# EAGLE design BT-PROGRAMER (EAGLE 9.1.0)
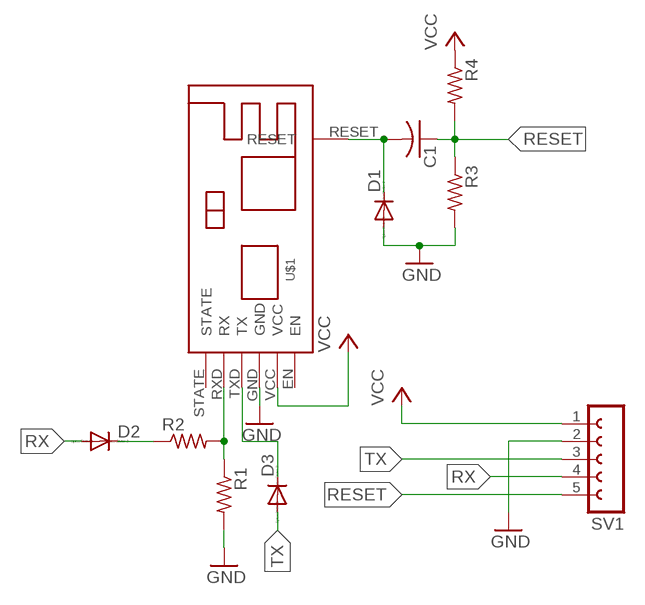
[diagram p0: schematic, sheet 1]

## Parts
C1  C-USC0603  [C0603]
D1  DIODE-DO-214AC  [DO-214AC]
D2  DIODE-DO-214AC  [DO-214AC]
D3  DIODE-DO-214AC  [DO-214AC]
R1  R-US_M1206  [M1206]
R2  R-US_M1206  [M1206]
R3  R-US_M1206  [M1206]
R4  R-US_M1206  [M1206]
SV1  FE05-1  [FE05-1]
U$1  HC-05-PROG  [HC-05-PROG]

## Nets
GND: D1.A R1.2 R3.2 SV1.2 U$1.GND
N$1: R1.1 R2.2 U$1.RXD(RX)
N$2: C1.2 D1.C U$1.RESET
N$5: D2.C R2.1
N$6: D3.C U$1.TXD(TX)
RESET: C1.1 R3.1 R4.2 SV1.5
RX: D2.A SV1.4
TX: D3.A SV1.3
VCC: R4.1 SV1.1 U$1.VCC
Unconnected: U$1.EN U$1.STATE

## Library data of the parts
C1 = rcl:C-US: CAPACITOR, American symbol; SPICEPREFIX: C
D1-D3 = diode:DIODE-: DIODE
R1-R4 = rcl:R-US_: RESISTOR, American symbol; SPICEPREFIX: R
SV1 = con-lsta:FE05-1: FEMALE HEADER; OC_FARNELL: unknown; OC_NEWARK: unknown
U$1 = hc-xx:HC-05-PROG: Con funcion adicional para programar arduino remotamente. HC-05 module is an easy to use Bluetooth SPP (Serial Port Protocol) module, designed for transparent wireless serial connection setup. Serial port Bluetooth module is fully qualified Bluetooth V2.0+EDR (Enhanced Data Rate) 3Mbps Modulation with complete 2.4GHz radio transceiver and baseband. It uses CSR Bluecore 04-External single chip Bluetooth system with CMOS technology and with AFH(Adaptive Frequency Hopping Feature). It has the footprint as small as 12.7mmx27mm. Hope it will simplify your overall design/development cycle.

## Board
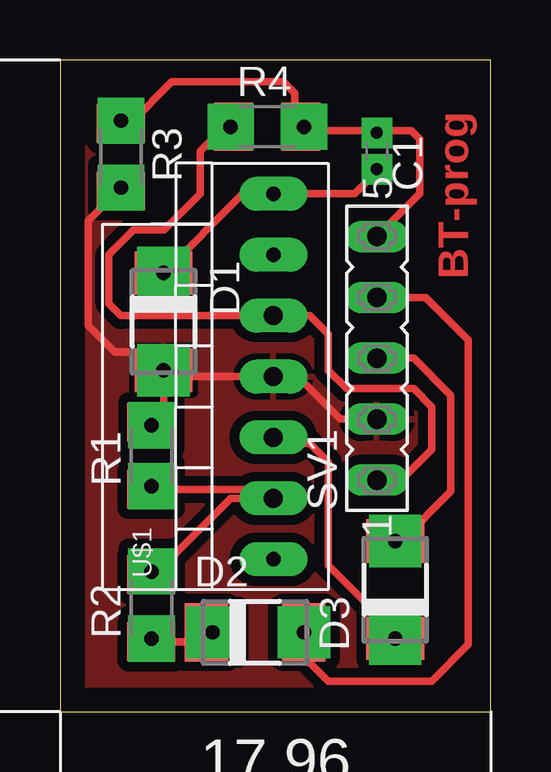
[diagram p1: board, top side]

Size 17.96 x 27.17 mm. Coordinates in mm from the lower left corner, seen from the top.
Outline: 0,0 17.96,0 17.96,27.17 0,27.17 0,0
Copper layers (1*16): Top 0.035mm / dielectric 1.5mm / Bottom 0.035mm
Design rules "default": minimum track width 6mil, minimum drill 0.35mm, track to track 6mil, track to pad 6mil, pad to pad 6mil, via to via 6mil, smd to smd 6mil, copper to edge 40mil, drill to drill 6mil, minimum pad ring 10mil, minimum via ring 8mil, stop-mask expansion 4mil, vias tented up to drill 0mil, thermal gap 10mil

### Footprints (pad centres in the part's own frame; a part is rotated, then mirrored left to right if it is on the bottom)
C0603 = smd 1.1 x 1: 1 -0.85,0; 2 0.85,0
DO-214AC = smd 1.8 x 2.4: A 2.025,0; C -2.025,0
M1206 = smd 1.6 x 2: 1 -1.4,0; 2 1.4,0
FE05-1 = drill 0.813 long: 1 -5.08,0; 2 -2.54,0; 3 0,0; 4 2.54,0; 5 5.08,0
HC-05-PROG = drill 0.6 pad 1.422 long: EN 6.35,-1.27; RESET 8.89,-1.27; STATE -6.35,-1.27 | drill 0.8 pad 1.422 long: GND 1.27,-1.27; RXD -3.81,-1.27; TXD -1.27,-1.27; VCC 3.81,-1.27

### Placement (x,y rotation side)
C1  13.21,23.37 270 top
D1  4.32,16.26 270 top
D2  8.13,3.3 0 top
D3  13.97,5.08 90 top
R1  3.81,10.67 90 top
R2  3.81,4.32 90 top
R3  2.54,23.11 270 top
R4  8.64,24.38 0 top
SV1  13.21,14.73 90 top
U$1  7.62,12.7 90 top

### Tracks (layer width: path | path; a pad name or v marks a point on that pad's centre or on a via)
GND  (via drill 0.6 pad 2.18)
  Top 0.305: 3.56,14.99 D1.A 4.32,12.58 R1.2 | SV1.2 11.68,12.19 9.91,13.97 U$1.GND 4.83,13.97 4.07,14.73 3.82,14.99 3.56,14.99 | R3.2 2.41,21.71 1.17,20.47 1.17,16.1 2.29,14.99 3.05,14.99 3.56,14.99
  other vias: 4.32,14.22
  pour Top (isolate 0.406): 0,26.16 0,26.42 0.76,27.18 17.02,27.18 18.03,26.16 18.03,1.02 17.02,0 1.02,0 0,1.02
N$1
  Top 0.305: R2.2 3.94,5.72 7.11,8.89 U$1.RXD 8.51,9.27 R1.1
N$2  (via drill 0.6 pad 2.18)
  Top 0.305: C1.2 12.28,21.59 U$1.RESET 7.62,21.59 v4.32,18.29 D1.C
N$3  (via drill 0.6 pad 1.93)
  other vias: 3.81,9.4
N$4  (via drill 0.6 pad 1.93)
  other vias: 3.81,5.84
N$5
  Top 0.305: R2.1 5.72,2.92 D2.C
N$6
  Top 0.305: D3.C 13.97,3.3 11.18,6.1 11.18,10.41 10.41,11.18 8.64,11.18 | 8.38,11.18 8.64,11.18 | 8.64,11.18 U$1.TXD
N$7  (via drill 0.6 pad 1.93)
  other vias: 3.81,3.05
N$8  (via drill 0.6 pad 1.93)
  other vias: 3.81,11.94
N$9  (via drill 0.6 pad 1.93)
  other vias: 2.54,21.84
N$10  (via drill 0.6 pad 1.93)
  other vias: 2.54,24.64
N$11  (via drill 0.6 pad 1.93)
  other vias: 10.16,24.38
N$12  (via drill 0.6 pad 2.18)
  other vias: 13.97,7.11
N$13  (via drill 0.6 pad 2.18)
  other vias: 13.97,3.05
N$14  (via drill 0.6 pad 2.18)
  other vias: 10.16,3.3
N$15  (via drill 0.6 pad 2.18)
  other vias: 6.35,3.3
N$16  (via drill 0.5 pad 1.27)
  other vias: 13.21,24.13
N$17  (via drill 0.5 pad 1.27)
  other vias: 13.21,22.61
RESET
  Top 0.305: SV1.5 14.99,21.59 14.99,23.88 14.64,24.22 C1.1 10.2,24.22 R4.2 9.78,24.64 9.78,25.78 9.31,26.25 4.66,26.25 2.92,24.51 R3.1
RX
  Top 0.305: SV1.4 15.24,17.27 17.02,15.49 17.02,2.79 15.49,1.27 11.18,1.27 10.15,2.29 D2.A
TX
  Top 0.305: D3.A 14.22,7.11 16.28,9.17 16.28,13.18 14.73,14.73 SV1.3
VCC  (via drill 0.6 pad 1.93)
  Top 0.305: R4.1 v7.11,24.38 6.86,24.38 5.84,23.37 5.84,21.59 4.32,20.07 3.05,20.07 2.03,19.05 2.03,17.02 2.54,16.51 U$1.VCC 10.41,16.51 11.18,15.75 11.18,14.22 11.94,13.46 14.73,13.46 15.49,12.7 15.49,10.92 14.22,9.65 SV1.1

### Text on the board
Top: BT-prog